# Altium project roach2_project rev2.PrjPCB (part 12 of 13)
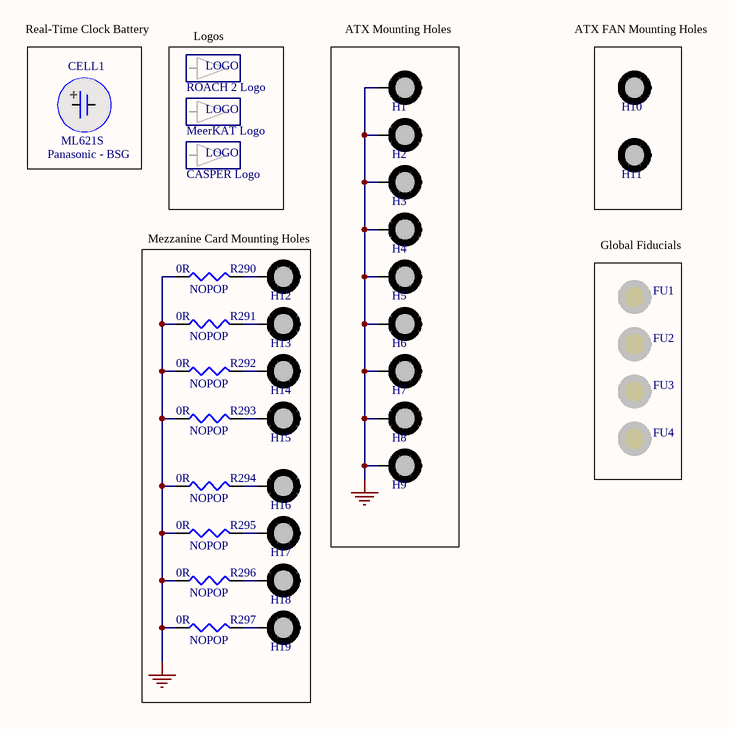
[diagram p25: misc.SchDoc]
## Nets that join several sheets
1V0: power_supply (R26.2 R27.2 U9.17), ppc_net (15 pins), ppc_sys (R37.2), v6_net (15 pins)
1V5: ddr3 (44 pins), gpio_led (F8.1 R430.2 R435.2 U68.1), jtag_levelxlate (R476.2 U75.1 U75.5), power_supply (18 pins), qdr0_1 (53 pins), qdr2_3 (61 pins), v6_config_io_16_17_21_22 (14 pins), v6_io_12_13_14_15 (31 pins), v6_io_23_24_25_26 (9 pins), v6_io_27_28_32_33 (31 pins), v6_io_34_35_36_37_38 (27 pins), ppc_power (5 pins), mgt_breakout (20 pins)
1V8: power_supply (R10.2 R11.2 U6.6 U8.14), ppc_cpld (5 pins), qdr0_1 (38 pins), qdr2_3 (38 pins), zdoks (10 pins), ppc_power (L9.1), ppc_ddr2_0 (29 pins), ppc_ddr2_1 (104 pins)
2V5: gpio_led (8 pins), jtag_levelxlate (20 pins), power_supply (R3.2 R4.2 U3.6 U6.10), ppc_net (33 pins), v6_config_io_16_17_21_22 (25 pins), v6_io_23_24_25_26 (23 pins), v6_io_34_35_36_37_38 (8 pins), zdoks (10 pins), ppc_power (L12.1), mgt_breakout (L25.2 L26.2 R493.1 R494.1), v6_net (32 pins)
3V3: ddr3 (J6.236 R376.2 R377.2), gpio_led (6 pins), jtag_levelxlate (37 pins), power_supply (8 pins), ppc_cpld (28 pins), ppc_extbus (25 pins), ppc_serial (29 pins), ppc_sys (15 pins), zdoks (10 pins), ppc_power (L10.1 L15.1 L16.2), mgt_breakout (36 pins)
3V3AUX: hwmon_2 (5 pins), gpio_led (8 pins), jtag_levelxlate (R49.2 R50.2), power_supply (8 pins), ppc_serial (18 pins), ppc_sys (R257.1)
5V: ddr3 (C661.2 R380.1 R382.1 U63.10), gpio_led (12 pins), power_supply (8 pins), ppc_serial (F6.2), qdr0_1 (C566.2 R323.1 R324.1 U59.10), qdr2_3 (C626.2 R374.1 R375.1 U62.10), zdoks (10 pins), ppc_ddr2_0 (C216.2 R189.2 R191.2 U41.10)
5VAUX: hwmon_2 (7 pins), gpio_led (F5.1 R449.1 R451.2), power_supply (15 pins)
12V: gpio_led (C728.2 U70.7), power_supply (6 pins)
DDR2_VREF: ppc_ddr2_0 (11 pins), ppc_ddr2_1 (12 pins)
GND: hwmon_2 (12 pins), ddr3 (99 pins), gpio_led (118 pins), jtag_levelxlate (90 pins), power_supply (94 pins), ppc_cpld (41 pins), ppc_extbus (10 pins), ppc_net (75 pins), ppc_serial (91 pins), ppc_sys (34 pins), qdr0_1 (119 pins), qdr2_3 (121 pins), v6_config_io_16_17_21_22 (21 pins), v6_io_12_13_14_15 (16 pins), v6_io_23_24_25_26 (12 pins), v6_io_27_28_32_33 (14 pins), v6_io_34_35_36_37_38 (13 pins), zdoks (104 pins), ppc_power (303 pins), mgt_breakout (238 pins), v6_net (73 pins), ppc_ddr2_0 (28 pins), ppc_ddr2_1 (104 pins), misc (17 pins)
N12V: gpio_led (C485.2 U70.4), power_supply (J1.14 P1.10)
QDR01_VREF: qdr0_1 (6 pins), v6_io_27_28_32_33 (6 pins), v6_io_34_35_36_37_38 (12 pins)
QDR23_VREF: qdr2_3 (6 pins), v6_config_io_16_17_21_22 (C368.2 U1.AY25 U1.BA27), v6_io_12_13_14_15 (6 pins), v6_io_27_28_32_33 (6 pins)
VCC_JTAG: jtag_levelxlate (C730.2 C731.2 P17.6 R468.1), ppc_sys (P2.12)
AUX_CLK_N: gpio_led (U67.10), v6_io_34_35_36_37_38 (U1.AW16)
AUX_CLK_P: gpio_led (U67.12), v6_io_34_35_36_37_38 (U1.AV16)
AUX_SYNCI_N: gpio_led (U69.10), v6_io_34_35_36_37_38 (U1.BB17)
AUX_SYNCI_P: gpio_led (U69.12), v6_io_34_35_36_37_38 (U1.BB16)
AUX_SYNCO_N: gpio_led (U71.4), v6_io_34_35_36_37_38 (U1.BA17)
AUX_SYNCO_P: gpio_led (U71.3), v6_io_34_35_36_37_38 (U1.BA16)
BOOT_CFG0: ppc_cpld (R342.1 U46.74), ppc_serial (U35.1)
BOOT_CFG1: ppc_cpld (R345.2 U46.73), ppc_serial (U37.1)
BOOT_CFG2: ppc_cpld (R344.2 U46.72), ppc_serial (U39.1)
BOOT_CFG_DISn: ppc_cpld (U46.71), ppc_serial (R150.1 U35.6 U37.6 U39.6)
CPLD_IRQn: ppc_cpld (U46.90), ppc_sys (R88.1 U2.V32)
CPLD_PRDY: jtag_levelxlate (R269.1 U86.2), ppc_cpld (U46.95)
CPLD_TCK: jtag_levelxlate (U77.16), ppc_cpld (U46.48)
CPLD_TDI: jtag_levelxlate (R479.2), ppc_cpld (U46.45)
CPLD_TDO: jtag_levelxlate (R480.1 U52.4), ppc_cpld (U46.83)
CPLD_TMS: jtag_levelxlate (U79.9), ppc_cpld (U46.47)
DDR2.A0: ppc_ddr2_0 (R151.2 RP6.1), ppc_ddr2_1 (U42.M8 U43.M8 U44.M8 U45.M8)
DDR2.A1: ppc_ddr2_0 (R152.2 RP4.1), ppc_ddr2_1 (U42.M3 U43.M3 U44.M3 U45.M3)
DDR2.A2: ppc_ddr2_0 (R153.2 RP3.3), ppc_ddr2_1 (U42.M7 U43.M7 U44.M7 U45.M7)
DDR2.A3: ppc_ddr2_0 (R154.2 RP4.2), ppc_ddr2_1 (U42.N2 U43.N2 U44.N2 U45.N2)
DDR2.A4: ppc_ddr2_0 (R155.2 RP3.1), ppc_ddr2_1 (U42.N8 U43.N8 U44.N8 U45.N8)
DDR2.A5: ppc_ddr2_0 (R156.2 RP3.2), ppc_ddr2_1 (U42.N3 U43.N3 U44.N3 U45.N3)
DDR2.A6: ppc_ddr2_0 (R157.2 RP3.4), ppc_ddr2_1 (U42.N7 U43.N7 U44.N7 U45.N7)
DDR2.A7: ppc_ddr2_0 (R158.2 RP2.1), ppc_ddr2_1 (U42.P2 U43.P2 U44.P2 U45.P2)
DDR2.A8: ppc_ddr2_0 (R159.2 RP2.4), ppc_ddr2_1 (U42.P8 U43.P8 U44.P8 U45.P8)
DDR2.A9: ppc_ddr2_0 (R160.2 RP2.2), ppc_ddr2_1 (U42.P3 U43.P3 U44.P3 U45.P3)
DDR2.A10: ppc_ddr2_0 (R161.2 RP5.3), ppc_ddr2_1 (U42.M2 U43.M2 U44.M2 U45.M2)
DDR2.A11: ppc_ddr2_0 (R162.2 RP1.2), ppc_ddr2_1 (U42.P7 U43.P7 U44.P7 U45.P7)
DDR2.A12: ppc_ddr2_0 (R163.2 RP1.3), ppc_ddr2_1 (U42.R2 U43.R2 U44.R2 U45.R2)
DDR2.A13: ppc_ddr2_0 (R164.2 RP4.3), ppc_ddr2_1 (U42.R8 U43.R8 U44.R8 U45.R8)
DDR2.BA0: ppc_ddr2_0 (R165.2 RP5.2), ppc_ddr2_1 (U42.L2 U43.L2 U44.L2 U45.L2)
DDR2.BA1: ppc_ddr2_0 (R166.2 RP5.1), ppc_ddr2_1 (U42.L3 U43.L3 U44.L3 U45.L3)
DDR2.BA2: ppc_ddr2_0 (R167.2 RP1.4), ppc_ddr2_1 (U42.L1 U43.L1 U44.L1 U45.L1)
DDR2.CASn: ppc_ddr2_0 (R169.2 RP4.4), ppc_ddr2_1 (U42.L7 U43.L7 U44.L7 U45.L7)
DDR2.CKE: ppc_ddr2_0 (R287.2 RP2.3), ppc_ddr2_1 (U42.K2 U43.K2 U44.K2 U45.K2)
DDR2.CLK_N0: ppc_ddr2_0 (R177.2 U40.40), ppc_ddr2_1 (U42.K8)
DDR2.CLK_N1: ppc_ddr2_0 (R178.2 U40.30), ppc_ddr2_1 (U43.K8)
DDR2.CLK_N2: ppc_ddr2_0 (R179.2 U40.18), ppc_ddr2_1 (U44.K8)
DDR2.CLK_N3: ppc_ddr2_0 (R180.2 U40.17), ppc_ddr2_1 (U45.K8)
DDR2.CLK_P0: ppc_ddr2_0 (R177.1 U40.39), ppc_ddr2_1 (U42.J8)
DDR2.CLK_P1: ppc_ddr2_0 (R178.1 U40.29), ppc_ddr2_1 (U43.J8)
DDR2.CLK_P2: ppc_ddr2_0 (R179.1 U40.19), ppc_ddr2_1 (U44.J8)
DDR2.CLK_P3: ppc_ddr2_0 (R180.1 U40.16), ppc_ddr2_1 (U45.J8)
DDR2.DM0: ppc_ddr2_0 (U2.AL21), ppc_ddr2_1 (U42.F3)
DDR2.DM1: ppc_ddr2_0 (U2.AM18), ppc_ddr2_1 (U42.B3)
DDR2.DM2: ppc_ddr2_0 (U2.AP15), ppc_ddr2_1 (U43.F3)
DDR2.DM3: ppc_ddr2_0 (U2.AL14), ppc_ddr2_1 (U43.B3)
DDR2.DM4: ppc_ddr2_0 (U2.AE4), ppc_ddr2_1 (U44.F3)
DDR2.DM5: ppc_ddr2_0 (U2.AB3), ppc_ddr2_1 (U44.B3)
DDR2.DM6: ppc_ddr2_0 (U2.Y1), ppc_ddr2_1 (U45.F3)
DDR2.DM7: ppc_ddr2_0 (U2.U3), ppc_ddr2_1 (U45.B3)
DDR2.DQ0: ppc_ddr2_0 (U2.AN22), ppc_ddr2_1 (U42.G8)
DDR2.DQ1: ppc_ddr2_0 (U2.AP22), ppc_ddr2_1 (U42.G2)
DDR2.DQ2: ppc_ddr2_0 (U2.AM20), ppc_ddr2_1 (U42.H7)
DDR2.DQ3: ppc_ddr2_0 (U2.AL20), ppc_ddr2_1 (U42.H3)
DDR2.DQ4: ppc_ddr2_0 (U2.AL22), ppc_ddr2_1 (U42.H1)
DDR2.DQ5: ppc_ddr2_0 (U2.AM22), ppc_ddr2_1 (U42.H9)
DDR2.DQ6: ppc_ddr2_0 (U2.AN21), ppc_ddr2_1 (U42.F1)
DDR2.DQ7: ppc_ddr2_0 (U2.AP21), ppc_ddr2_1 (U42.F9)
DDR2.DQ8: ppc_ddr2_0 (U2.AP20), ppc_ddr2_1 (U42.C8)
DDR2.DQ9: ppc_ddr2_0 (U2.AL18), ppc_ddr2_1 (U42.C2)
DDR2.DQ10: ppc_ddr2_0 (U2.AN17), ppc_ddr2_1 (U42.D7)
DDR2.DQ11: ppc_ddr2_0 (U2.AP17), ppc_ddr2_1 (U42.D3)
DDR2.DQ12: ppc_ddr2_0 (U2.AN20), ppc_ddr2_1 (U42.D1)
DDR2.DQ13: ppc_ddr2_0 (U2.AP19), ppc_ddr2_1 (U42.D9)
DDR2.DQ14: ppc_ddr2_0 (U2.AN18), ppc_ddr2_1 (U42.B1)
DDR2.DQ15: ppc_ddr2_0 (U2.AP18), ppc_ddr2_1 (U42.B9)
DDR2.DQ16: ppc_ddr2_0 (U2.AM16), ppc_ddr2_1 (U43.G8)
DDR2.DQ17: ppc_ddr2_0 (U2.AP16), ppc_ddr2_1 (U43.G2)
DDR2.DQ18: ppc_ddr2_0 (U2.AL15), ppc_ddr2_1 (U43.H7)
DDR2.DQ19: ppc_ddr2_0 (U2.AP14), ppc_ddr2_1 (U43.H3)
DDR2.DQ20: ppc_ddr2_0 (U2.AL17), ppc_ddr2_1 (U43.H1)
DDR2.DQ21: ppc_ddr2_0 (U2.AM17), ppc_ddr2_1 (U43.H9)
DDR2.DQ22: ppc_ddr2_0 (U2.AN15), ppc_ddr2_1 (U43.F1)
DDR2.DQ23: ppc_ddr2_0 (U2.AM15), ppc_ddr2_1 (U43.F9)
DDR2.DQ24: ppc_ddr2_0 (U2.AP13), ppc_ddr2_1 (U43.C8)
DDR2.DQ25: ppc_ddr2_0 (U2.AN13), ppc_ddr2_1 (U43.C2)
DDR2.DQ26: ppc_ddr2_0 (U2.AP12), ppc_ddr2_1 (U43.D7)
DDR2.DQ27: ppc_ddr2_0 (U2.AL12), ppc_ddr2_1 (U43.D3)
DDR2.DQ28: ppc_ddr2_0 (U2.AM14), ppc_ddr2_1 (U43.D1)
DDR2.DQ29: ppc_ddr2_0 (U2.AN14), ppc_ddr2_1 (U43.D9)
DDR2.DQ30: ppc_ddr2_0 (U2.AL13), ppc_ddr2_1 (U43.B1)
DDR2.DQ31: ppc_ddr2_0 (U2.AM12), ppc_ddr2_1 (U43.B9)
DDR2.DQ32: ppc_ddr2_0 (U2.AF3), ppc_ddr2_1 (U44.G8)
DDR2.DQ33: ppc_ddr2_0 (U2.AF1), ppc_ddr2_1 (U44.G2)
DDR2.DQ34: ppc_ddr2_0 (U2.AD4), ppc_ddr2_1 (U44.H7)
DDR2.DQ35: ppc_ddr2_0 (U2.AD3), ppc_ddr2_1 (U44.H3)
DDR2.DQ36: ppc_ddr2_0 (U2.AG3), ppc_ddr2_1 (U44.H1)
DDR2.DQ37: ppc_ddr2_0 (U2.AF2), ppc_ddr2_1 (U44.H9)
DDR2.DQ38: ppc_ddr2_0 (U2.AE2), ppc_ddr2_1 (U44.F1)
DDR2.DQ39: ppc_ddr2_0 (U2.AE1), ppc_ddr2_1 (U44.F9)
DDR2.DQ40: ppc_ddr2_0 (U2.AC3), ppc_ddr2_1 (U44.C8)
DDR2.DQ41: ppc_ddr2_0 (U2.AC1), ppc_ddr2_1 (U44.C2)
DDR2.DQ42: ppc_ddr2_0 (U2.AA4), ppc_ddr2_1 (U44.D7)
DDR2.DQ43: ppc_ddr2_0 (U2.AA3), ppc_ddr2_1 (U44.D3)
DDR2.DQ44: ppc_ddr2_0 (U2.AD2), ppc_ddr2_1 (U44.D1)
DDR2.DQ45: ppc_ddr2_0 (U2.AC4), ppc_ddr2_1 (U44.D9)
DDR2.DQ46: ppc_ddr2_0 (U2.AB1), ppc_ddr2_1 (U44.B1)
DDR2.DQ47: ppc_ddr2_0 (U2.AB2), ppc_ddr2_1 (U44.B9)
DDR2.DQ48: ppc_ddr2_0 (U2.Y3), ppc_ddr2_1 (U45.G8)
DDR2.DQ49: ppc_ddr2_0 (U2.Y2), ppc_ddr2_1 (U45.G2)
DDR2.DQ50: ppc_ddr2_0 (U2.V4), ppc_ddr2_1 (U45.H7)
DDR2.DQ51: ppc_ddr2_0 (U2.V3), ppc_ddr2_1 (U45.H3)
DDR2.DQ52: ppc_ddr2_0 (U2.AA2), ppc_ddr2_1 (U45.H1)
DDR2.DQ53: ppc_ddr2_0 (U2.AA1), ppc_ddr2_1 (U45.H9)
DDR2.DQ54: ppc_ddr2_0 (U2.W3), ppc_ddr2_1 (U45.F1)
DDR2.DQ55: ppc_ddr2_0 (U2.W1), ppc_ddr2_1 (U45.F9)
DDR2.DQ56: ppc_ddr2_0 (U2.U1), ppc_ddr2_1 (U45.C8)
DDR2.DQ57: ppc_ddr2_0 (U2.U2), ppc_ddr2_1 (U45.C2)
DDR2.DQ58: ppc_ddr2_0 (U2.T4), ppc_ddr2_1 (U45.D7)
DDR2.DQ59: ppc_ddr2_0 (U2.R1), ppc_ddr2_1 (U45.D3)
DDR2.DQ60: ppc_ddr2_0 (U2.V2), ppc_ddr2_1 (U45.D1)
DDR2.DQ61: ppc_ddr2_0 (U2.V1), ppc_ddr2_1 (U45.D9)
DDR2.DQ62: ppc_ddr2_0 (U2.T1), ppc_ddr2_1 (U45.B1)
DDR2.DQ63: ppc_ddr2_0 (U2.T3), ppc_ddr2_1 (U45.B9)
DDR2.DQS0: ppc_ddr2_0 (U2.AM21), ppc_ddr2_1 (U42.F7)
DDR2.DQS1: ppc_ddr2_0 (U2.AM19), ppc_ddr2_1 (U42.B7)
DDR2.DQS2: ppc_ddr2_0 (U2.AL16), ppc_ddr2_1 (U43.F7)
DDR2.DQS3: ppc_ddr2_0 (U2.AM13), ppc_ddr2_1 (U43.B7)
DDR2.DQS4: ppc_ddr2_0 (U2.AE3), ppc_ddr2_1 (U44.F7)
DDR2.DQS5: ppc_ddr2_0 (U2.AB4), ppc_ddr2_1 (U44.B7)
DDR2.DQS6: ppc_ddr2_0 (U2.W4), ppc_ddr2_1 (U45.F7)
DDR2.DQS7: ppc_ddr2_0 (U2.U4), ppc_ddr2_1 (U45.B7)
DDR2.ODT: ppc_ddr2_0 (R285.2 RP6.2), ppc_ddr2_1 (U42.K9 U43.K9 U44.K9 U45.K9)
DDR2.RASn: ppc_ddr2_0 (R168.2 RP5.4), ppc_ddr2_1 (U42.K7 U43.K7 U44.K7 U45.K7)
DDR2.Sn: ppc_ddr2_0 (R286.2 RP6.3), ppc_ddr2_1 (U42.L8 U43.L8 U44.L8 U45.L8)
DDR2.WEn: ppc_ddr2_0 (R170.2 RP6.4), ppc_ddr2_1 (U42.K3 U43.K3 U44.K3 U45.K3)
DDR3.A0: ddr3 (J6.188), v6_io_12_13_14_15 (U1.BB38)
DDR3.A1: ddr3 (J6.181), v6_io_12_13_14_15 (U1.BB37)
DDR3.A2: ddr3 (J6.61), v6_io_12_13_14_15 (U1.BA37)
DDR3.A3: ddr3 (J6.180), v6_io_12_13_14_15 (U1.BA36)
DDR3.A4: ddr3 (J6.59), v6_io_12_13_14_15 (U1.BB36)
DDR3.A5: ddr3 (J6.58), v6_io_12_13_14_15 (U1.BA35)
DDR3.A6: ddr3 (J6.178), v6_io_12_13_14_15 (U1.AW36)
DDR3.A7: ddr3 (J6.56), v6_io_12_13_14_15 (U1.AY35)
DDR3.A8: ddr3 (J6.177), v6_io_12_13_14_15 (U1.BA34)
DDR3.A9: ddr3 (J6.175), v6_io_12_13_14_15 (U1.AW35)
DDR3.A10: ddr3 (J6.70), v6_io_12_13_14_15 (U1.BB39)
DDR3.A11: ddr3 (J6.55), v6_io_12_13_14_15 (U1.BB34)
DDR3.A12: ddr3 (J6.174), v6_io_12_13_14_15 (U1.AY34)
DDR3.A13: ddr3 (J6.196), v6_io_12_13_14_15 (U1.AT34)
DDR3.A14: ddr3 (J6.172), v6_config_io_16_17_21_22 (U1.BB33)
DDR3.A15: ddr3 (J6.171), v6_config_io_16_17_21_22 (U1.BB31)
DDR3.BA0: ddr3 (J6.71), v6_io_12_13_14_15 (U1.AW37)
DDR3.BA1: ddr3 (J6.190), v6_io_12_13_14_15 (U1.AY37)
DDR3.BA2: ddr3 (J6.52), v6_config_io_16_17_21_22 (U1.AY32)
DDR3.CASn: ddr3 (J6.74), v6_io_12_13_14_15 (U1.AU34)
DDR3.CK_N: ddr3 (J6.185), v6_config_io_16_17_21_22 (U1.AY33)
DDR3.CK_P: ddr3 (J6.184), v6_config_io_16_17_21_22 (U1.BA32)
DDR3.CKE0: ddr3 (J6.50), v6_io_12_13_14_15 (U1.AV34)
DDR3.CKE1: ddr3 (J6.169), v6_io_12_13_14_15 (U1.AV35)
DDR3.DM0: ddr3 (J6.125), v6_io_23_24_25_26 (R340.1)
DDR3.DM1: ddr3 (J6.134), v6_config_io_16_17_21_22 (R300.1)
DDR3.DM2: ddr3 (J6.143), v6_config_io_16_17_21_22 (R334.1)
DDR3.DM3: ddr3 (J6.152), v6_config_io_16_17_21_22 (R335.1)
DDR3.DM4: ddr3 (J6.203), v6_io_23_24_25_26 (R339.1)
DDR3.DM5: ddr3 (J6.212), v6_io_12_13_14_15 (R336.1)
DDR3.DM6: ddr3 (J6.221), v6_io_12_13_14_15 (R337.1)
DDR3.DM7: ddr3 (J6.230), v6_io_12_13_14_15 (R338.1)
DDR3.DM8: ddr3 (J6.161), v6_io_23_24_25_26 (R341.1)
DDR3.DQ0: ddr3 (J6.3), v6_io_23_24_25_26 (U1.AH25)
DDR3.DQ1: ddr3 (J6.4), v6_io_23_24_25_26 (U1.AM29)
DDR3.DQ2: ddr3 (J6.9), v6_io_23_24_25_26 (U1.AM28)
DDR3.DQ3: ddr3 (J6.10), v6_io_23_24_25_26 (U1.AN29)
DDR3.DQ4: ddr3 (J6.122), v6_io_23_24_25_26 (U1.AG27)
DDR3.DQ5: ddr3 (J6.123), v6_io_23_24_25_26 (U1.AH26)
DDR3.DQ6: ddr3 (J6.128), v6_io_23_24_25_26 (U1.AL27)
DDR3.DQ7: ddr3 (J6.129), v6_io_23_24_25_26 (U1.AK25)
DDR3.DQ8: ddr3 (J6.12), v6_config_io_16_17_21_22 (U1.AP28)
DDR3.DQ9: ddr3 (J6.13), v6_config_io_16_17_21_22 (U1.AY30)
DDR3.DQ10: ddr3 (J6.18), v6_config_io_16_17_21_22 (U1.AR29)
DDR3.DQ11: ddr3 (J6.19), v6_config_io_16_17_21_22 (U1.AR30)
DDR3.DQ12: ddr3 (J6.131), v6_config_io_16_17_21_22 (U1.AM27)
DDR3.DQ13: ddr3 (J6.132), v6_config_io_16_17_21_22 (U1.AN26)
DDR3.DQ14: ddr3 (J6.137), v6_config_io_16_17_21_22 (U1.AW28)
DDR3.DQ15: ddr3 (J6.138), v6_config_io_16_17_21_22 (U1.AV29)
DDR3.DQ16: ddr3 (J6.21), v6_config_io_16_17_21_22 (U1.AY28)
DDR3.DQ17: ddr3 (J6.22), v6_config_io_16_17_21_22 (U1.AU29)
DDR3.DQ18: ddr3 (J6.27), v6_config_io_16_17_21_22 (U1.AW31)
DDR3.DQ19: ddr3 (J6.28), v6_config_io_16_17_21_22 (U1.AU31)
DDR3.DQ20: ddr3 (J6.140), v6_config_io_16_17_21_22 (U1.AL26)
DDR3.DQ21: ddr3 (J6.141), v6_config_io_16_17_21_22 (U1.BB28)
DDR3.DQ22: ddr3 (J6.146), v6_config_io_16_17_21_22 (U1.AV30)
DDR3.DQ23: ddr3 (J6.147), v6_config_io_16_17_21_22 (U1.AT30)
DDR3.DQ24: ddr3 (J6.30), v6_config_io_16_17_21_22 (U1.AT29)
DDR3.DQ25: ddr3 (J6.31), v6_config_io_16_17_21_22 (U1.AW30)
DDR3.DQ26: ddr3 (J6.36), v6_config_io_16_17_21_22 (U1.BA31)
DDR3.DQ27: ddr3 (J6.37), v6_config_io_16_17_21_22 (U1.AV31)
DDR3.DQ28: ddr3 (J6.149), v6_config_io_16_17_21_22 (U1.AP27)
DDR3.DQ29: ddr3 (J6.150), v6_config_io_16_17_21_22 (U1.AR28)
DDR3.DQ30: ddr3 (J6.155), v6_config_io_16_17_21_22 (U1.BB29)
DDR3.DQ31: ddr3 (J6.156), v6_config_io_16_17_21_22 (U1.AT31)
DDR3.DQ32: ddr3 (J6.81), v6_io_23_24_25_26 (U1.AU33)
DDR3.DQ33: ddr3 (J6.82), v6_io_23_24_25_26 (U1.AV33)
DDR3.DQ34: ddr3 (J6.87), v6_io_23_24_25_26 (U1.AP33)
DDR3.DQ35: ddr3 (J6.88), v6_io_23_24_25_26 (U1.AM32)
DDR3.DQ36: ddr3 (J6.200), v6_io_23_24_25_26 (U1.AT32)
DDR3.DQ37: ddr3 (J6.201), v6_io_23_24_25_26 (U1.AW33)
DDR3.DQ38: ddr3 (J6.206), v6_io_23_24_25_26 (U1.AR33)
DDR3.DQ39: ddr3 (J6.207), v6_io_23_24_25_26 (U1.AP32)
DDR3.DQ40: ddr3 (J6.90), v6_io_12_13_14_15 (U1.BA40)
DDR3.DQ41: ddr3 (J6.91), v6_io_12_13_14_15 (U1.BA41)
DDR3.DQ42: ddr3 (J6.96), v6_io_12_13_14_15 (U1.AK34)
DDR3.DQ43: ddr3 (J6.97), v6_io_12_13_14_15 (U1.AP38)
DDR3.DQ44: ddr3 (J6.209), v6_io_12_13_14_15 (U1.AM34)
DDR3.DQ45: ddr3 (J6.210), v6_io_12_13_14_15 (U1.AL35)
DDR3.DQ46: ddr3 (J6.215), v6_io_12_13_14_15 (U1.AM36)
DDR3.DQ47: ddr3 (J6.216), v6_io_12_13_14_15 (U1.AY40)
DDR3.DQ48: ddr3 (J6.99), v6_io_12_13_14_15 (U1.BA42)
DDR3.DQ49: ddr3 (J6.100), v6_io_12_13_14_15 (U1.AW41)
DDR3.DQ50: ddr3 (J6.105), v6_io_12_13_14_15 (U1.AU39)
DDR3.DQ51: ddr3 (J6.106), v6_io_12_13_14_15 (U1.AL37)
DDR3.DQ52: ddr3 (J6.218), v6_io_12_13_14_15 (U1.AW40)
DDR3.DQ53: ddr3 (J6.219), v6_io_12_13_14_15 (U1.AV40)
DDR3.DQ54: ddr3 (J6.224), v6_io_12_13_14_15 (U1.BB41)
DDR3.DQ55: ddr3 (J6.225), v6_io_12_13_14_15 (U1.AN38)
DDR3.DQ56: ddr3 (J6.108), v6_io_12_13_14_15 (U1.AY42)
DDR3.DQ57: ddr3 (J6.109), v6_io_12_13_14_15 (U1.AP40)
DDR3.DQ58: ddr3 (J6.114), v6_io_12_13_14_15 (U1.AR42)
DDR3.DQ59: ddr3 (J6.115), v6_io_12_13_14_15 (U1.AN41)
DDR3.DQ60: ddr3 (J6.227), v6_io_12_13_14_15 (U1.AN40)
DDR3.DQ61: ddr3 (J6.228), v6_io_12_13_14_15 (U1.AN39)
DDR3.DQ62: ddr3 (J6.233), v6_io_12_13_14_15 (U1.AT41)
DDR3.DQ63: ddr3 (J6.234), v6_io_12_13_14_15 (U1.AT42)
DDR3.DQ64: ddr3 (J6.39), v6_io_23_24_25_26 (U1.AL29)
DDR3.DQ65: ddr3 (J6.40), v6_io_23_24_25_26 (U1.AN30)
DDR3.DQ66: ddr3 (J6.45), v6_io_23_24_25_26 (U1.AL31)
DDR3.DQ67: ddr3 (J6.46), v6_io_23_24_25_26 (U1.AG28)
DDR3.DQ68: ddr3 (J6.158), v6_io_23_24_25_26 (U1.AJ26)
DDR3.DQ69: ddr3 (J6.159), v6_io_23_24_25_26 (U1.AK29)
DDR3.DQ70: ddr3 (J6.164), v6_io_23_24_25_26 (U1.AL30)
DDR3.DQ71: ddr3 (J6.165), v6_io_23_24_25_26 (U1.AP30)
DDR3.DQS_N0: ddr3 (J6.6), v6_io_23_24_25_26 (U1.AJ27)
DDR3.DQS_N1: ddr3 (J6.15), v6_config_io_16_17_21_22 (U1.AV28)
DDR3.DQS_N2: ddr3 (J6.24), v6_config_io_16_17_21_22 (U1.AT27)
DDR3.DQS_N3: ddr3 (J6.33), v6_config_io_16_17_21_22 (U1.BA29)
DDR3.DQS_N4: ddr3 (J6.84), v6_io_23_24_25_26 (U1.AN34)
DDR3.DQS_N5: ddr3 (J6.93), v6_io_12_13_14_15 (U1.AL36)
DDR3.DQS_N6: ddr3 (J6.102), v6_io_12_13_14_15 (U1.AT39)
DDR3.DQS_N7: ddr3 (J6.111), v6_io_12_13_14_15 (U1.AU41)
DDR3.DQS_N8: ddr3 (J6.42), v6_io_23_24_25_26 (U1.AN31)
DDR3.DQS_P0: ddr3 (J6.7), v6_io_23_24_25_26 (U1.AK27)
DDR3.DQS_P1: ddr3 (J6.16), v6_config_io_16_17_21_22 (U1.AU28)
DDR3.DQS_P2: ddr3 (J6.25), v6_config_io_16_17_21_22 (U1.AR27)
DDR3.DQS_P3: ddr3 (J6.34), v6_config_io_16_17_21_22 (U1.AY29)
DDR3.DQS_P4: ddr3 (J6.85), v6_io_23_24_25_26 (U1.AN33)
DDR3.DQS_P5: ddr3 (J6.94), v6_io_12_13_14_15 (U1.AK35)
DDR3.DQS_P6: ddr3 (J6.103), v6_io_12_13_14_15 (U1.AR39)
DDR3.DQS_P7: ddr3 (J6.112), v6_io_12_13_14_15 (U1.AV41)
DDR3.DQS_P8: ddr3 (J6.43), v6_io_23_24_25_26 (U1.AP31)
DDR3.ODT0: ddr3 (J6.195), v6_io_12_13_14_15 (U1.AU36)
DDR3.ODT1: ddr3 (J6.77), v6_io_12_13_14_15 (U1.AV36)
DDR3.RASn: ddr3 (J6.192), v6_io_12_13_14_15 (U1.AY38)
DDR3.RESETn: ddr3 (J6.168), v6_io_34_35_36_37_38 (U1.N13)
DDR3.Sn0: ddr3 (J6.193), v6_io_12_13_14_15 (U1.AW38)
DDR3.Sn1: ddr3 (J6.76), v6_io_12_13_14_15 (U1.AR37)
DDR3.Sn2: ddr3 (J6.79), v6_io_12_13_14_15 (U1.AP36)
DDR3.Sn3: ddr3 (J6.198), v6_io_12_13_14_15 (U1.AH34)
DDR3.WEn: ddr3 (J6.73), v6_io_12_13_14_15 (U1.AV38)
EPB.PADDR5: jtag_levelxlate (U76.55), ppc_extbus (R352.2 U2.D25 U30.G8)
EPB.PADDR6: jtag_levelxlate (U76.54), ppc_extbus (R351.2 U2.C25 U30.F8)
EPB.PADDR7: jtag_levelxlate (U76.52), ppc_extbus (R350.2 U2.B25 U30.C8)
EPB.PADDR8: jtag_levelxlate (U76.51), ppc_extbus (U2.A25 U30.B8)
EPB.PADDR9: jtag_levelxlate (U76.49), ppc_extbus (U2.C24 U30.C5)
EPB.PADDR10: jtag_levelxlate (U76.48), ppc_extbus (U2.D24 U30.D4)
EPB.PADDR11: jtag_levelxlate (U76.47), ppc_extbus (U2.B24 U30.D5)
EPB.PADDR12: jtag_levelxlate (U76.45), ppc_extbus (U2.D23 U30.C4)
EPB.PADDR13: jtag_levelxlate (U76.44), ppc_extbus (U2.A24 U30.B3)
EPB.PADDR14: jtag_levelxlate (U76.43), ppc_extbus (U2.C23 U30.E7)
EPB.PADDR15: jtag_levelxlate (U76.42), ppc_extbus (U2.A23 U30.D7)
EPB.PADDR16: jtag_levelxlate (U76.41), ppc_extbus (U2.D22 U30.C7)
EPB.PADDR17: jtag_levelxlate (U76.40), ppc_extbus (U2.C22 U30.A7)
EPB.PADDR18: jtag_levelxlate (U76.38), ppc_extbus (U2.A22 U30.B7)
EPB.PADDR19: jtag_levelxlate (U76.37), ppc_extbus (U2.D21 U30.D6)
EPB.PADDR20: jtag_levelxlate (U76.36), ppc_extbus (U2.C21 U30.C6)
EPB.PADDR21: jtag_levelxlate (U76.34), ppc_extbus (U2.B21 U30.A6)
EPB.PADDR22: jtag_levelxlate (U76.33), ppc_extbus (U2.A21 U30.B6)
EPB.PADDR23: jtag_levelxlate (U80.55), ppc_extbus (U2.D20 U30.A3)
EPB.PADDR24: jtag_levelxlate (U76.31), ppc_extbus (U2.C20 U30.C3)
EPB.PADDR25: jtag_levelxlate (U76.30), ppc_extbus (U2.B20 U30.D3)
EPB.PADDR26: jtag_levelxlate (U80.54), ppc_cpld (U46.8), ppc_extbus (U2.D19 U30.B2)
EPB.PADDR27: jtag_levelxlate (U80.52), ppc_cpld (U46.7), ppc_extbus (U2.C19 U30.A2)
EPB.PADDR28: jtag_levelxlate (U80.51), ppc_cpld (U46.6), ppc_extbus (U2.A19 U30.C2)
EPB.PADDR29: jtag_levelxlate (U80.49), ppc_cpld (U46.4), ppc_extbus (U2.D18 U30.D2)
EPB.PADDR30: ppc_cpld (U46.3), ppc_extbus (U2.C18 U30.E2)
EPB.PADDR31: ppc_cpld (U46.2), ppc_extbus (U2.B18)
EPB.PBEn0: jtag_levelxlate (U80.44), ppc_extbus (U2.A15)
EPB.PBEn1: jtag_levelxlate (U80.45), ppc_extbus (U2.B15)
EPB.PBEn2: jtag_levelxlate (U80.47), ppc_extbus (U2.C15)
EPB.PBEn3: jtag_levelxlate (U80.48), ppc_extbus (U2.D15)
EPB.PBLASTn: jtag_levelxlate (U80.41), ppc_extbus (U2.B7)
EPB.PCSn_CPLD: ppc_cpld (U46.97), ppc_extbus (R108.1 R118.2)
EPB.PCSn_FPGA0: jtag_levelxlate (U80.38), ppc_extbus (R107.1 R117.2)
EPB.PCSn_FPGA1: jtag_levelxlate (U80.40), ppc_extbus (R110.1 R121.2)
EPB.PCSn_SMAP: jtag_levelxlate (U80.37), ppc_extbus (R109.1 R120.2)
EPB.PDATA0: jtag_levelxlate (U81.47), ppc_cpld (U46.16), ppc_extbus (U2.C14 U30.G7)
EPB.PDATA1: jtag_levelxlate (U81.46), ppc_cpld (U46.15), ppc_extbus (U2.D14 U30.F6)
EPB.PDATA2: jtag_levelxlate (U81.44), ppc_cpld (U46.14), ppc_extbus (U2.A13 U30.G6)
EPB.PDATA3: jtag_levelxlate (U81.43), ppc_cpld (U46.13), ppc_extbus (U2.B13 U30.F5)
EPB.PDATA4: jtag_levelxlate (U81.41), ppc_cpld (U46.12), ppc_extbus (U2.C13 U30.G4)
EPB.PDATA5: jtag_levelxlate (U81.40), ppc_cpld (U46.11), ppc_extbus (U2.D13 U30.F4)
EPB.PDATA6: jtag_levelxlate (U81.38), ppc_cpld (U46.10), ppc_extbus (U2.A12 U30.G3)
EPB.PDATA7: jtag_levelxlate (U81.37), ppc_cpld (U46.9), ppc_extbus (U2.C12 U30.F3)
EPB.PDATA8: jtag_levelxlate (U81.36), ppc_extbus (U2.A11 U30.E6)
EPB.PDATA9: jtag_levelxlate (U81.35), ppc_extbus (U2.D12 U30.H6)
EPB.PDATA10: jtag_levelxlate (U81.33), ppc_extbus (U2.B11 U30.E5)
EPB.PDATA11: jtag_levelxlate (U81.32), ppc_extbus (U2.C11 U30.H5)
EPB.PDATA12: jtag_levelxlate (U81.30), ppc_extbus (U2.D11 U30.H4)
EPB.PDATA13: jtag_levelxlate (U81.29), ppc_extbus (U2.A10 U30.E4)
EPB.PDATA14: jtag_levelxlate (U81.27), ppc_extbus (U2.B10 U30.H3)
EPB.PDATA15: jtag_levelxlate (U81.26), ppc_extbus (U2.C10 U30.E3)
EPB.PDATA16: jtag_levelxlate (U78.47), ppc_extbus (U2.E3)
EPB.PDATA17: jtag_levelxlate (U78.46), ppc_extbus (U2.C1)
EPB.PDATA18: jtag_levelxlate (U78.44), ppc_extbus (U2.D2)
EPB.PDATA19: jtag_levelxlate (U78.43), ppc_extbus (U2.E4)
EPB.PDATA20: jtag_levelxlate (U78.41), ppc_extbus (U2.D1)
EPB.PDATA21: jtag_levelxlate (U78.40), ppc_extbus (U2.E1)
EPB.PDATA22: jtag_levelxlate (U78.38), ppc_extbus (U2.F4)
EPB.PDATA23: jtag_levelxlate (U78.37), ppc_extbus (U2.F3)
EPB.PDATA24: jtag_levelxlate (U78.36), ppc_extbus (U2.F2)
EPB.PDATA25: jtag_levelxlate (U78.35), ppc_extbus (U2.F1)
EPB.PDATA26: jtag_levelxlate (U78.33), ppc_extbus (U2.G3)
EPB.PDATA27: jtag_levelxlate (U78.32), ppc_extbus (U2.G4)
EPB.PDATA28: jtag_levelxlate (U78.30), ppc_extbus (U2.G2)
EPB.PDATA29: jtag_levelxlate (U78.29), ppc_extbus (U2.G1)
EPB.PDATA30: jtag_levelxlate (U78.27), ppc_extbus (U2.H4)
EPB.PDATA31: jtag_levelxlate (U78.26), ppc_extbus (TP29.1 U2.H3)
EPB.PERCLK: jtag_levelxlate (U73.3 U74.2), ppc_cpld (U46.22), ppc_extbus (R112.2 R122.2 R123.1 TP28.1)
EPB.POEn: jtag_levelxlate (U80.43), ppc_cpld (U46.1), ppc_extbus (U2.B14 U30.G2)
EPB.PRDY: jtag_levelxlate (U86.4), ppc_extbus (TP40.1 U2.C17)
EPB.PWRn: jtag_levelxlate (U80.42), ppc_cpld (U46.96), ppc_extbus (U2.A14 U30.A5)
FAULTn: gpio_led (Q17.1 R225.2), ppc_sys (R85.1 U2.AC31)
FLASH_BUSYn: ppc_cpld (U46.17), ppc_extbus (R106.1 U30.A4)
FTDI_CTRL0: ppc_cpld (U46.66), ppc_serial (U33.34)
FTDI_CTRL1: ppc_cpld (U46.67), ppc_serial (U33.33)
FTDI_CTRL2: ppc_cpld (U46.68), ppc_serial (U33.32)
FTDI_CTRL3: ppc_cpld (U46.70), ppc_serial (U33.30)
FTDI_TCK: jtag_levelxlate (R462.1), ppc_serial (U33.16)
FTDI_TDI: jtag_levelxlate (R464.1), ppc_serial (U33.17)
FTDI_TDO: jtag_levelxlate (R467.2), ppc_serial (U33.18)
FTDI_TMS: jtag_levelxlate (R465.1), ppc_serial (U33.19)
FTDI_TRSTn: jtag_levelxlate (R466.1), ppc_serial (U33.21)
GETH_IRQn: ppc_net (U50.L1), ppc_sys (R84.1 U2.AD33)
JTAG_GRAB: jtag_levelxlate (R252.2 U52.6 U53.6), ppc_serial (R243.2)
MGT_GPIO0: v6_io_34_35_36_37_38 (U1.J16), mgt_breakout (J7.C17)
MGT_GPIO1: v6_io_34_35_36_37_38 (U1.H20), mgt_breakout (J7.C18)
MGT_GPIO2: v6_io_34_35_36_37_38 (U1.N18), mgt_breakout (J7.C19)
MGT_GPIO3: v6_io_34_35_36_37_38 (U1.B16), mgt_breakout (J7.C20)
MGT_GPIO4: v6_io_27_28_32_33 (U1.L29), mgt_breakout (J7.C21)
MGT_GPIO5: v6_io_27_28_32_33 (U1.K29), mgt_breakout (J7.C22)
MGT_GPIO6: v6_io_34_35_36_37_38 (U1.N15), mgt_breakout (J8.C17)
MGT_GPIO7: v6_io_34_35_36_37_38 (U1.P16), mgt_breakout (J8.C18)
MGT_GPIO8: v6_io_34_35_36_37_38 (U1.N16), mgt_breakout (J8.C19)
MGT_GPIO9: v6_io_34_35_36_37_38 (U1.P17), mgt_breakout (J8.C20)
MGT_GPIO10: v6_io_34_35_36_37_38 (U1.L15), mgt_breakout (J8.C21)
MGT_GPIO11: v6_io_34_35_36_37_38 (U1.K19), mgt_breakout (J8.C22)
MMC_DMAACK: ppc_cpld (U46.93), ppc_sys (U2.T34)
MMC_DMAEOT: ppc_cpld (U46.92), ppc_sys (U2.T32)
MMC_DMAREQ: ppc_cpld (U46.91), ppc_sys (U2.U32)
PCTRL_EN: power_supply (Q19.1 R30.2), ppc_serial (R139.2)
PPC_GPIO0: gpio_led (P14.5 SP41.2), ppc_serial (U2.C6)
PPC_GPIO1: gpio_led (P14.4 SP40.2), ppc_serial (U2.A4)
PPC_GPIO2: gpio_led (P14.3 SP39.2), ppc_serial (U2.M3)
PPC_GPIO3: gpio_led (P14.2 SP38.2), ppc_serial (U2.P4)
PPC_GPIO4: gpio_led (Q12.1 R448.2 SP37.2), ppc_serial (U2.C5)
PPC_SCL: ddr3 (R378.2), ppc_serial (5 pins)
PPC_SDA: ddr3 (R379.2), ppc_serial (6 pins)
PPC_TCK: jtag_levelxlate (U77.14), ppc_sys (U2.P2)
PPC_TDI: jtag_levelxlate (R477.2), ppc_sys (U2.K3)
PPC_TDO: jtag_levelxlate (R478.1), ppc_sys (U2.B22)
PPC_TMS: jtag_levelxlate (U79.7), ppc_sys (U2.K2)
PPCNET_MDC: ppc_net (R235.2 U2.AL34 U50.L3), v6_net (U64.L3)
PPCNET_MDIO: ppc_net (R240.2 U2.AK34 U50.M1), v6_net (U64.M1)
PPCNET_TCK: jtag_levelxlate (U77.12), ppc_net (U50.L9)
PPCNET_TDI: jtag_levelxlate (R484.2), ppc_net (U50.L7)
PPCNET_TDO: jtag_levelxlate (R485.1), ppc_net (U50.K8)
PPCNET_TMS: jtag_levelxlate (U79.5), ppc_net (U50.L8)
QDR0.A0: qdr0_1 (RP9.1 U57.B4), v6_io_34_35_36_37_38 (U1.E19)
QDR0.A1: qdr0_1 (RP14.3 U57.B8), v6_io_34_35_36_37_38 (U1.J15)
QDR0.A2: qdr0_1 (R275.1 U57.C5), v6_io_34_35_36_37_38 (U1.J17)
QDR0.A3: qdr0_1 (R272.1 U57.C7), v6_io_34_35_36_37_38 (U1.G18)
QDR0.A4: qdr0_1 (RP13.2 U57.N5), v6_io_34_35_36_37_38 (U1.G19)
QDR0.A5: qdr0_1 (RP13.3 U57.N6), v6_io_34_35_36_37_38 (U1.G16)
QDR0.A6: qdr0_1 (RP13.4 U57.N7), v6_io_34_35_36_37_38 (U1.E18)
QDR0.A7: qdr0_1 (RP8.2 U57.P4), v6_io_34_35_36_37_38 (U1.F17)
QDR0.A8: qdr0_1 (RP8.4 U57.P5), v6_io_34_35_36_37_38 (U1.K18)
QDR0.A9: qdr0_1 (RP7.1 U57.P7), v6_io_34_35_36_37_38 (U1.C18)
QDR0.A10: qdr0_1 (RP7.3 U57.P8), v6_io_34_35_36_37_38 (U1.A17)
QDR0.A11: qdr0_1 (RP14.2 U57.A9), v6_io_34_35_36_37_38 (U1.G17)
QDR0.A12: qdr0_1 (RP8.1 U57.R3), v6_io_34_35_36_37_38 (U1.M18)
QDR0.A13: qdr0_1 (RP8.3 U57.R4), v6_io_34_35_36_37_38 (U1.B19)
QDR0.A14: qdr0_1 (RP13.1 U57.R5), v6_io_34_35_36_37_38 (U1.B17)
QDR0.A15: qdr0_1 (R114.1 U57.R7), v6_io_34_35_36_37_38 (U1.B18)
QDR0.A16: qdr0_1 (RP7.2 U57.R8), v6_io_34_35_36_37_38 (U1.D18)
QDR0.A17: qdr0_1 (RP7.4 U57.R9), v6_io_34_35_36_37_38 (U1.K17)
QDR0.A18: qdr0_1 (RP9.3 U57.A3), v6_io_34_35_36_37_38 (U1.C19)
QDR0.A19: qdr0_1 (RP14.1 U57.A10), v6_io_34_35_36_37_38 (U1.M16)
QDR0.A20: qdr0_1 (RP9.4 U57.A2), v6_io_34_35_36_37_38 (U1.F19)
QDR0.D0: qdr0_1 (U57.P10), v6_io_34_35_36_37_38 (U1.C16)
QDR0.D1: qdr0_1 (U57.N11), v6_io_34_35_36_37_38 (U1.N14)
QDR0.D2: qdr0_1 (U57.M11), v6_io_34_35_36_37_38 (U1.H13)
QDR0.D3: qdr0_1 (U57.K10), v6_io_34_35_36_37_38 (U1.K12)
QDR0.D4: qdr0_1 (U57.J11), v6_io_34_35_36_37_38 (U1.K13)
QDR0.D5: qdr0_1 (U57.G11), v6_io_34_35_36_37_38 (U1.J12)
QDR0.D6: qdr0_1 (U57.E10), v6_io_34_35_36_37_38 (U1.E14)
QDR0.D7: qdr0_1 (U57.D11), v6_io_34_35_36_37_38 (U1.D12)
QDR0.D8: qdr0_1 (U57.C11), v6_io_34_35_36_37_38 (U1.F12)
QDR0.D9: qdr0_1 (U57.N10), v6_io_34_35_36_37_38 (U1.H15)
QDR0.D10: qdr0_1 (U57.M9), v6_io_34_35_36_37_38 (U1.A15)
QDR0.D11: qdr0_1 (U57.L9), v6_io_34_35_36_37_38 (U1.E15)
QDR0.D12: qdr0_1 (U57.J9), v6_io_34_35_36_37_38 (U1.B14)
QDR0.D13: qdr0_1 (U57.G10), v6_io_34_35_36_37_38 (U1.A14)
QDR0.D14: qdr0_1 (U57.F9), v6_io_34_35_36_37_38 (U1.A16)
QDR0.D15: qdr0_1 (U57.D10), v6_io_34_35_36_37_38 (U1.L12)
QDR0.D16: qdr0_1 (U57.C9), v6_io_34_35_36_37_38 (U1.C14)
QDR0.D17: qdr0_1 (U57.B9), v6_io_34_35_36_37_38 (U1.E13)
QDR0.D18: qdr0_1 (U57.B3), v6_io_34_35_36_37_38 (U1.E20)
QDR0.D19: qdr0_1 (U57.C3), v6_io_34_35_36_37_38 (U1.F20)
QDR0.D20: qdr0_1 (U57.D2), v6_io_34_35_36_37_38 (U1.A21)
QDR0.D21: qdr0_1 (U57.F3), v6_io_34_35_36_37_38 (U1.C20)
QDR0.D22: qdr0_1 (U57.G2), v6_io_34_35_36_37_38 (U1.B22)
QDR0.D23: qdr0_1 (U57.J3), v6_io_34_35_36_37_38 (U1.L19)
QDR0.D24: qdr0_1 (U57.L3), v6_io_34_35_36_37_38 (U1.G23)
QDR0.D25: qdr0_1 (U57.M3), v6_io_34_35_36_37_38 (U1.L21)
QDR0.D26: qdr0_1 (U57.N2), v6_io_34_35_36_37_38 (U1.D23)
QDR0.D27: qdr0_1 (U57.C1), v6_io_34_35_36_37_38 (U1.B21)
QDR0.D28: qdr0_1 (U57.D1), v6_io_34_35_36_37_38 (U1.F21)
QDR0.D29: qdr0_1 (U57.E2), v6_io_34_35_36_37_38 (U1.G21)
QDR0.D30: qdr0_1 (U57.G1), v6_io_34_35_36_37_38 (U1.D21)
QDR0.D31: qdr0_1 (U57.J1), v6_io_34_35_36_37_38 (U1.K22)
QDR0.D32: qdr0_1 (U57.K2), v6_io_34_35_36_37_38 (U1.L20)
QDR0.D33: qdr0_1 (U57.M1), v6_io_34_35_36_37_38 (U1.B23)
QDR0.D34: qdr0_1 (U57.N1), v6_io_34_35_36_37_38 (U1.D22)
QDR0.D35: qdr0_1 (U57.P2), v6_io_34_35_36_37_38 (U1.E24)
QDR0.DOFFn: qdr0_1 (U57.H1), v6_io_34_35_36_37_38 (U1.A19)
QDR0.K: qdr0_1 (U57.B6), v6_io_34_35_36_37_38 (U1.D17)
QDR0.Kn: qdr0_1 (U57.A6), v6_io_34_35_36_37_38 (U1.E17)
QDR0.Q0: qdr0_1 (U57.P11), v6_io_34_35_36_37_38 (U1.G14)
QDR0.Q1: qdr0_1 (U57.M10), v6_io_34_35_36_37_38 (U1.M14)
QDR0.Q2: qdr0_1 (U57.L11), v6_io_34_35_36_37_38 (U1.M12)
QDR0.Q3: qdr0_1 (U57.K11), v6_io_34_35_36_37_38 (U1.M13)
QDR0.Q4: qdr0_1 (U57.J10), v6_io_34_35_36_37_38 (U1.H14)
QDR0.Q5: qdr0_1 (U57.F11), v6_io_34_35_36_37_38 (U1.J13)
QDR0.Q6: qdr0_1 (U57.E11), v6_io_34_35_36_37_38 (U1.E12)
QDR0.Q7: qdr0_1 (U57.C10), v6_io_34_35_36_37_38 (U1.C13)
QDR0.Q8: qdr0_1 (U57.B11), v6_io_34_35_36_37_38 (U1.G12)
QDR0.Q9: qdr0_1 (U57.P9), v6_io_34_35_36_37_38 (U1.F15)
QDR0.Q10: qdr0_1 (U57.N9), v6_io_34_35_36_37_38 (U1.D16)
QDR0.Q11: qdr0_1 (U57.L10), v6_io_34_35_36_37_38 (U1.L11)
QDR0.Q12: qdr0_1 (U57.K9), v6_io_34_35_36_37_38 (U1.D15)
QDR0.Q13: qdr0_1 (U57.G9), v6_io_34_35_36_37_38 (U1.C15)
QDR0.Q14: qdr0_1 (U57.F10), v6_io_34_35_36_37_38 (U1.J11)
QDR0.Q15: qdr0_1 (U57.E9), v6_io_34_35_36_37_38 (U1.F14)
QDR0.Q16: qdr0_1 (U57.D9), v6_io_34_35_36_37_38 (U1.D13)
QDR0.Q17: qdr0_1 (U57.B10), v6_io_34_35_36_37_38 (U1.K14)
QDR0.Q18: qdr0_1 (U57.B2), v6_io_34_35_36_37_38 (U1.H21)
QDR0.Q19: qdr0_1 (U57.D3), v6_io_34_35_36_37_38 (U1.D20)
QDR0.Q20: qdr0_1 (U57.E3), v6_io_34_35_36_37_38 (U1.J20)
QDR0.Q21: qdr0_1 (U57.F2), v6_io_34_35_36_37_38 (U1.K20)
QDR0.Q22: qdr0_1 (U57.G3), v6_io_34_35_36_37_38 (U1.L22)
QDR0.Q23: qdr0_1 (U57.K3), v6_io_34_35_36_37_38 (U1.G22)
QDR0.Q24: qdr0_1 (U57.L2), v6_io_34_35_36_37_38 (U1.F22)
QDR0.Q25: qdr0_1 (U57.N3), v6_io_34_35_36_37_38 (U1.C23)
QDR0.Q26: qdr0_1 (U57.P3), v6_io_34_35_36_37_38 (U1.C24)
QDR0.Q27: qdr0_1 (U57.B1), v6_io_34_35_36_37_38 (U1.J21)
QDR0.Q28: qdr0_1 (U57.C2), v6_io_34_35_36_37_38 (U1.A20)
QDR0.Q29: qdr0_1 (U57.E1), v6_io_34_35_36_37_38 (U1.C21)
QDR0.Q30: qdr0_1 (U57.F1), v6_io_34_35_36_37_38 (U1.A24)
QDR0.Q31: qdr0_1 (U57.J2), v6_io_34_35_36_37_38 (U1.B24)
QDR0.Q32: qdr0_1 (U57.K1), v6_io_34_35_36_37_38 (U1.J22)
QDR0.Q33: qdr0_1 (U57.L1), v6_io_34_35_36_37_38 (U1.H23)
QDR0.Q34: qdr0_1 (U57.M2), v6_io_34_35_36_37_38 (U1.A22)
QDR0.Q35: qdr0_1 (U57.P1), v6_io_34_35_36_37_38 (U1.E23)
QDR0.RDn: qdr0_1 (RP14.4 U57.A8), v6_io_34_35_36_37_38 (U1.L16)
QDR0.WRn: qdr0_1 (RP9.2 U57.A4), v6_io_34_35_36_37_38 (U1.J18)
QDR0_TCK: jtag_levelxlate (U77.7), qdr0_1 (U57.R2)
QDR0_TDI: jtag_levelxlate (R480.2 U52.3), qdr0_1 (U57.R11)
QDR0_TDO: jtag_levelxlate (R481.1), qdr0_1 (U57.R1)
QDR0_TMS: jtag_levelxlate (U82.18), qdr0_1 (U57.R10)
QDR1.A0: qdr0_1 (RP12.1 U58.B4), v6_io_27_28_32_33 (U1.C30)
QDR1.A1: qdr0_1 (RP16.3 U58.B8), v6_io_27_28_32_33 (U1.A30)
QDR1.A2: qdr0_1 (R277.1 U58.C5), v6_io_27_28_32_33 (U1.G28)
QDR1.A3: qdr0_1 (R276.1 U58.C7), v6_io_27_28_32_33 (U1.E28)
QDR1.A4: qdr0_1 (RP15.2 U58.N5), v6_io_27_28_32_33 (U1.L26)
QDR1.A5: qdr0_1 (RP15.3 U58.N6), v6_io_27_28_32_33 (U1.G27)
QDR1.A6: qdr0_1 (RP15.4 U58.N7), v6_io_27_28_32_33 (U1.A31)
QDR1.A7: qdr0_1 (RP11.2 U58.P4), v6_io_27_28_32_33 (U1.J27)
QDR1.A8: qdr0_1 (RP11.4 U58.P5), v6_io_27_28_32_33 (U1.B29)
QDR1.A9: qdr0_1 (RP10.1 U58.P7), v6_io_27_28_32_33 (U1.R23)
QDR1.A10: qdr0_1 (RP10.3 U58.P8), v6_io_34_35_36_37_38 (U1.H26)
QDR1.A11: qdr0_1 (RP16.2 U58.A9), v6_io_27_28_32_33 (U1.F27)
QDR1.A12: qdr0_1 (RP11.1 U58.R3), v6_io_27_28_32_33 (U1.M26)
QDR1.A13: qdr0_1 (RP11.3 U58.R4), v6_io_27_28_32_33 (U1.N25)
QDR1.A14: qdr0_1 (RP15.1 U58.R5), v6_io_27_28_32_33 (U1.A29)
QDR1.A15: qdr0_1 (R274.1 U58.R7), v6_io_27_28_32_33 (U1.J26)
QDR1.A16: qdr0_1 (RP10.2 U58.R8), v6_io_27_28_32_33 (U1.N24)
QDR1.A17: qdr0_1 (RP10.4 U58.R9), v6_io_27_28_32_33 (U1.P23)
QDR1.A18: qdr0_1 (RP12.3 U58.A3), v6_io_27_28_32_33 (U1.L27)
QDR1.A19: qdr0_1 (RP16.1 U58.A10), v6_io_27_28_32_33 (U1.L25)
QDR1.A20: qdr0_1 (RP12.4 U58.A2), v6_io_27_28_32_33 (U1.A35)
QDR1.D0: qdr0_1 (U58.P10), v6_io_34_35_36_37_38 (U1.M24)
QDR1.D1: qdr0_1 (U58.N11), v6_io_34_35_36_37_38 (U1.P20)
QDR1.D2: qdr0_1 (U58.M11), v6_io_34_35_36_37_38 (U1.N21)
QDR1.D3: qdr0_1 (U58.K10), v6_io_34_35_36_37_38 (U1.F24)
QDR1.D4: qdr0_1 (U58.J11), v6_io_34_35_36_37_38 (U1.A25)
QDR1.D5: qdr0_1 (U58.G11), v6_io_34_35_36_37_38 (U1.A26)
QDR1.D6: qdr0_1 (U58.E10), v6_io_34_35_36_37_38 (U1.C25)
QDR1.D7: qdr0_1 (U58.D11), v6_io_34_35_36_37_38 (U1.B26)
QDR1.D8: qdr0_1 (U58.C11), v6_io_34_35_36_37_38 (U1.P22)
QDR1.D9: qdr0_1 (U58.N10), v6_io_34_35_36_37_38 (U1.M21)
QDR1.D10: qdr0_1 (U58.M9), v6_io_34_35_36_37_38 (U1.M22)
QDR1.D11: qdr0_1 (U58.L9), v6_io_34_35_36_37_38 (U1.G24)
QDR1.D12: qdr0_1 (U58.J9), v6_io_34_35_36_37_38 (U1.H24)
QDR1.D13: qdr0_1 (U58.G10), v6_io_34_35_36_37_38 (U1.F25)
QDR1.D14: qdr0_1 (U58.F9), v6_io_34_35_36_37_38 (U1.E25)
QDR1.D15: qdr0_1 (U58.D10), v6_io_34_35_36_37_38 (U1.D26)
QDR1.D16: qdr0_1 (U58.C9), v6_io_27_28_32_33 (U1.D28)
QDR1.D17: qdr0_1 (U58.B9), v6_io_34_35_36_37_38 (U1.E27)
QDR1.D18: qdr0_1 (U58.B3), v6_io_27_28_32_33 (U1.F31)
QDR1.D19: qdr0_1 (U58.C3), v6_io_27_28_32_33 (U1.C33)
QDR1.D20: qdr0_1 (U58.D2), v6_io_27_28_32_33 (U1.K28)
QDR1.D21: qdr0_1 (U58.F3), v6_io_27_28_32_33 (U1.D30)
QDR1.D22: qdr0_1 (U58.G2), v6_io_27_28_32_33 (U1.B34)
QDR1.D23: qdr0_1 (U58.J3), v6_io_27_28_32_33 (U1.B33)
QDR1.D24: qdr0_1 (U58.L3), v6_io_27_28_32_33 (U1.E35)
QDR1.D25: qdr0_1 (U58.M3), v6_io_27_28_32_33 (U1.D36)
QDR1.D26: qdr0_1 (U58.N2), v6_io_27_28_32_33 (U1.D37)
QDR1.D27: qdr0_1 (U58.C1), v6_io_27_28_32_33 (U1.E32)
QDR1.D28: qdr0_1 (U58.D1), v6_io_27_28_32_33 (U1.G32)
QDR1.D29: qdr0_1 (U58.E2), v6_io_27_28_32_33 (U1.K27)
QDR1.D30: qdr0_1 (U58.G1), v6_io_27_28_32_33 (U1.G33)
QDR1.D31: qdr0_1 (U58.J1), v6_io_27_28_32_33 (U1.H33)
QDR1.D32: qdr0_1 (U58.K2), v6_io_27_28_32_33 (U1.E33)
QDR1.D33: qdr0_1 (U58.M1), v6_io_27_28_32_33 (U1.C36)
QDR1.D34: qdr0_1 (U58.N1), v6_io_27_28_32_33 (U1.F34)
QDR1.D35: qdr0_1 (U58.P2), v6_io_27_28_32_33 (U1.D31)
QDR1.DOFFn: qdr0_1 (U58.H1), v6_io_27_28_32_33 (U1.R25)
QDR1.K: qdr0_1 (U58.B6), v6_io_27_28_32_33 (U1.B31)
QDR1.Kn: qdr0_1 (U58.A6), v6_io_27_28_32_33 (U1.F30)
QDR1.Q0: qdr0_1 (U58.P11), v6_io_34_35_36_37_38 (U1.M19)
QDR1.Q1: qdr0_1 (U58.M10), v6_io_34_35_36_37_38 (U1.K24)
QDR1.Q2: qdr0_1 (U58.L11), v6_io_34_35_36_37_38 (U1.P21)
QDR1.Q3: qdr0_1 (U58.K11), v6_io_34_35_36_37_38 (U1.K23)
QDR1.Q4: qdr0_1 (U58.J10), v6_io_34_35_36_37_38 (U1.J25)
QDR1.Q5: qdr0_1 (U58.F11), v6_io_34_35_36_37_38 (U1.D25)
QDR1.Q6: qdr0_1 (U58.E11), v6_io_34_35_36_37_38 (U1.F26)
QDR1.Q7: qdr0_1 (U58.C10), v6_io_34_35_36_37_38 (U1.G26)
QDR1.Q8: qdr0_1 (U58.B11), v6_io_34_35_36_37_38 (U1.D27)
QDR1.Q9: qdr0_1 (U58.P9), v6_io_34_35_36_37_38 (U1.K25)
QDR1.Q10: qdr0_1 (U58.N9), v6_io_34_35_36_37_38 (U1.L24)
QDR1.Q11: qdr0_1 (U58.L10), v6_io_34_35_36_37_38 (U1.J23)
QDR1.Q12: qdr0_1 (U58.K9), v6_io_34_35_36_37_38 (U1.N23)
QDR1.Q13: qdr0_1 (U58.G9), v6_io_34_35_36_37_38 (U1.B28)
QDR1.Q14: qdr0_1 (U58.F10), v6_io_34_35_36_37_38 (U1.B27)
QDR1.Q15: qdr0_1 (U58.E9), v6_io_34_35_36_37_38 (U1.A27)
QDR1.Q16: qdr0_1 (U58.D9), v6_io_34_35_36_37_38 (U1.C26)
QDR1.Q17: qdr0_1 (U58.B10), v6_io_34_35_36_37_38 (U1.C28)
QDR1.Q18: qdr0_1 (U58.B2), v6_io_27_28_32_33 (U1.H28)
QDR1.Q19: qdr0_1 (U58.D3), v6_io_27_28_32_33 (U1.A36)
QDR1.Q20: qdr0_1 (U58.E3), v6_io_27_28_32_33 (U1.B36)
QDR1.Q21: qdr0_1 (U58.F2), v6_io_27_28_32_33 (U1.E30)
QDR1.Q22: qdr0_1 (U58.G3), v6_io_27_28_32_33 (U1.G29)
QDR1.Q23: qdr0_1 (U58.K3), v6_io_27_28_32_33 (U1.J33)
QDR1.Q24: qdr0_1 (U58.L2), v6_io_27_28_32_33 (U1.D33)
QDR1.Q25: qdr0_1 (U58.N3), v6_io_27_28_32_33 (U1.B32)
QDR1.Q26: qdr0_1 (U58.P3), v6_io_27_28_32_33 (U1.J28)
QDR1.Q27: qdr0_1 (U58.B1), v6_io_27_28_32_33 (U1.F32)
QDR1.Q28: qdr0_1 (U58.C2), v6_io_27_28_32_33 (U1.C34)
QDR1.Q29: qdr0_1 (U58.E1), v6_io_27_28_32_33 (U1.D32)
QDR1.Q30: qdr0_1 (U58.F1), v6_io_27_28_32_33 (U1.J32)
QDR1.Q31: qdr0_1 (U58.J2), v6_io_27_28_32_33 (U1.A34)
QDR1.Q32: qdr0_1 (U58.K1), v6_io_27_28_32_33 (U1.C35)
QDR1.Q33: qdr0_1 (U58.L1), v6_io_27_28_32_33 (U1.E34)
QDR1.Q34: qdr0_1 (U58.M2), v6_io_27_28_32_33 (U1.A32)
QDR1.Q35: qdr0_1 (U58.P1), v6_io_27_28_32_33 (U1.P25)
QDR1.RDn: qdr0_1 (RP16.4 U58.A8), v6_io_27_28_32_33 (U1.C29)
QDR1.WRn: qdr0_1 (RP12.2 U58.A4), v6_io_27_28_32_33 (U1.C31)
QDR1_TCK: jtag_levelxlate (U77.5), qdr0_1 (U58.R2)
QDR1_TDI: jtag_levelxlate (R481.2), qdr0_1 (U58.R11)
QDR1_TDO: jtag_levelxlate (R482.1), qdr0_1 (U58.R1)
QDR1_TMS: jtag_levelxlate (U82.16), qdr0_1 (U58.R10)
QDR2.A0: qdr2_3 (RP19.1 U60.B4), v6_io_12_13_14_15 (U1.AK37)
QDR2.A1: qdr2_3 (RP24.3 U60.B8), v6_io_12_13_14_15 (U1.AG34)
QDR2.A2: qdr2_3 (R282.1 U60.C5), v6_io_12_13_14_15 (U1.AL40)
QDR2.A3: qdr2_3 (R280.1 U60.C7), v6_io_12_13_14_15 (U1.AK39)
QDR2.A4: qdr2_3 (RP23.2 U60.N5), v6_io_12_13_14_15 (U1.AJ41)
QDR2.A5: qdr2_3 (RP23.3 U60.N6), v6_io_12_13_14_15 (U1.AH41)
QDR2.A6: qdr2_3 (RP23.4 U60.N7), v6_io_12_13_14_15 (U1.AF39)
QDR2.A7: qdr2_3 (RP18.2 U60.P4), v6_io_12_13_14_15 (U1.AG39)
QDR2.A8: qdr2_3 (RP18.4 U60.P5), v6_io_12_13_14_15 (U1.AJ42)
QDR2.A9: qdr2_3 (RP17.1 U60.P7), v6_io_12_13_14_15 (U1.AG41)
QDR2.A10: qdr2_3 (RP17.3 U60.P8), v6_io_12_13_14_15 (U1.AG36)
QDR2.A11: qdr2_3 (RP24.2 U60.A9), v6_io_12_13_14_15 (U1.AK42)
QDR2.A12: qdr2_3 (RP18.1 U60.R3), v6_io_12_13_14_15 (U1.AJ40)
QDR2.A13: qdr2_3 (RP18.3 U60.R4), v6_io_12_13_14_15 (U1.AH39)
QDR2.A14: qdr2_3 (RP23.1 U60.R5), v6_io_12_13_14_15 (U1.AG38)
QDR2.A15: qdr2_3 (R278.1 U60.R7), v6_io_12_13_14_15 (U1.AG42)
QDR2.A16: qdr2_3 (RP17.2 U60.R8), v6_io_12_13_14_15 (U1.AF40)
QDR2.A17: qdr2_3 (RP17.4 U60.R9), v6_io_12_13_14_15 (U1.AJ35)
QDR2.A18: qdr2_3 (RP19.3 U60.A3), v6_io_12_13_14_15 (U1.AK38)
QDR2.A19: qdr2_3 (RP24.1 U60.A10), v6_io_12_13_14_15 (U1.AF37)
QDR2.A20: qdr2_3 (RP19.4 U60.A2), v6_io_12_13_14_15 (U1.AL39)
QDR2.D0: qdr2_3 (U60.P10), v6_io_12_13_14_15 (U1.AA41)
QDR2.D1: qdr2_3 (U60.N11), v6_io_12_13_14_15 (U1.AB41)
QDR2.D2: qdr2_3 (U60.M11), v6_io_12_13_14_15 (U1.AB36)
QDR2.D3: qdr2_3 (U60.K10), v6_io_12_13_14_15 (U1.AB33)
QDR2.D4: qdr2_3 (U60.J11), v6_io_12_13_14_15 (U1.AD42)
QDR2.D5: qdr2_3 (U60.G11), v6_io_12_13_14_15 (U1.AB32)
QDR2.D6: qdr2_3 (U60.E10), v6_io_12_13_14_15 (U1.AE40)
QDR2.D7: qdr2_3 (U60.D11), v6_io_12_13_14_15 (U1.AD37)
QDR2.D8: qdr2_3 (U60.C11), v6_io_12_13_14_15 (U1.AC33)
QDR2.D9: qdr2_3 (U60.N10), v6_io_12_13_14_15 (U1.AA42)
QDR2.D10: qdr2_3 (U60.M9), v6_io_12_13_14_15 (U1.AB39)
QDR2.D11: qdr2_3 (U60.L9), v6_io_12_13_14_15 (U1.AB38)
QDR2.D12: qdr2_3 (U60.J9), v6_io_12_13_14_15 (U1.AD41)
QDR2.D13: qdr2_3 (U60.G10), v6_io_12_13_14_15 (U1.AC36)
QDR2.D14: qdr2_3 (U60.F9), v6_io_12_13_14_15 (U1.AE39)
QDR2.D15: qdr2_3 (U60.D10), v6_io_12_13_14_15 (U1.AD36)
QDR2.D16: qdr2_3 (U60.C9), v6_io_12_13_14_15 (U1.AE34)
QDR2.D17: qdr2_3 (U60.B9), v6_io_12_13_14_15 (U1.AG37)
QDR2.D18: qdr2_3 (U60.B3), v6_io_12_13_14_15 (U1.AJ37)
QDR2.D19: qdr2_3 (U60.C3), v6_io_12_13_14_15 (U1.AJ38)
QDR2.D20: qdr2_3 (U60.D2), v6_io_12_13_14_15 (U1.AM39)
QDR2.D21: qdr2_3 (U60.F3), v6_io_12_13_14_15 (U1.AL41)
QDR2.D22: qdr2_3 (U60.G2), v6_io_12_13_14_15 (U1.AF34)
QDR2.D23: qdr2_3 (U60.J3), v6_io_12_13_14_15 (U1.AD32)
QDR2.D24: qdr2_3 (U60.L3), v6_io_12_13_14_15 (U1.AP35)
QDR2.D25: qdr2_3 (U60.M3), v6_io_27_28_32_33 (U1.AR20)
QDR2.D26: qdr2_3 (U60.N2), v6_io_12_13_14_15 (U1.AF36)
QDR2.D27: qdr2_3 (U60.C1), v6_io_12_13_14_15 (U1.AM38)
QDR2.D28: qdr2_3 (U60.D1), v6_io_12_13_14_15 (U1.AP41)
QDR2.D29: qdr2_3 (U60.E2), v6_io_12_13_14_15 (U1.AK40)
QDR2.D30: qdr2_3 (U60.G1), v6_io_27_28_32_33 (U1.AT20)
QDR2.D31: qdr2_3 (U60.J1), v6_io_12_13_14_15 (U1.AP42)
QDR2.D32: qdr2_3 (U60.K2), v6_io_12_13_14_15 (U1.AM37)
QDR2.D33: qdr2_3 (U60.M1), v6_io_23_24_25_26 (U1.AM31)
QDR2.D34: qdr2_3 (U60.N1), v6_io_23_24_25_26 (U1.AR32)
QDR2.D35: qdr2_3 (U60.P2), v6_io_23_24_25_26 (U1.AU32)
QDR2.DOFFn: qdr2_3 (U60.H1), v6_io_34_35_36_37_38 (U1.P18)
QDR2.K: qdr2_3 (U60.B6), v6_io_12_13_14_15 (U1.AH40)
QDR2.Kn: qdr2_3 (U60.A6), v6_io_12_13_14_15 (U1.AM42)
QDR2.Q0: qdr2_3 (U60.P11), v6_io_12_13_14_15 (U1.AA40)
QDR2.Q1: qdr2_3 (U60.M10), v6_io_12_13_14_15 (U1.AE33)
QDR2.Q2: qdr2_3 (U60.L11), v6_io_12_13_14_15 (U1.AE32)
QDR2.Q3: qdr2_3 (U60.K11), v6_io_12_13_14_15 (U1.AC40)
QDR2.Q4: qdr2_3 (U60.J10), v6_io_12_13_14_15 (U1.AC34)
QDR2.Q5: qdr2_3 (U60.F11), v6_io_12_13_14_15 (U1.AE42)
QDR2.Q6: qdr2_3 (U60.E11), v6_io_12_13_14_15 (U1.AD33)
QDR2.Q7: qdr2_3 (U60.C10), v6_io_12_13_14_15 (U1.AE38)
QDR2.Q8: qdr2_3 (U60.B11), v6_io_12_13_14_15 (U1.AE37)
QDR2.Q9: qdr2_3 (U60.P9), v6_io_12_13_14_15 (U1.AB42)
QDR2.Q10: qdr2_3 (U60.N9), v6_io_12_13_14_15 (U1.AB37)
QDR2.Q11: qdr2_3 (U60.L10), v6_io_12_13_14_15 (U1.AC41)
QDR2.Q12: qdr2_3 (U60.K9), v6_io_12_13_14_15 (U1.AC38)
QDR2.Q13: qdr2_3 (U60.G9), v6_io_12_13_14_15 (U1.AD40)
QDR2.Q14: qdr2_3 (U60.F10), v6_io_12_13_14_15 (U1.AD38)
QDR2.Q15: qdr2_3 (U60.E9), v6_io_12_13_14_15 (U1.AF41)
QDR2.Q16: qdr2_3 (U60.D9), v6_io_12_13_14_15 (U1.AF42)
QDR2.Q17: qdr2_3 (U60.B10), v6_io_12_13_14_15 (U1.AE35)
QDR2.Q18: qdr2_3 (U60.B2), v6_io_12_13_14_15 (U1.AR38)
QDR2.Q19: qdr2_3 (U60.D3), v6_io_27_28_32_33 (U1.AJ21)
QDR2.Q20: qdr2_3 (U60.E3), v6_io_12_13_14_15 (U1.AP37)
QDR2.Q21: qdr2_3 (U60.F2), v6_io_12_13_14_15 (U1.AT37)
QDR2.Q22: qdr2_3 (U60.G3), v6_io_12_13_14_15 (U1.AN36)
QDR2.Q23: qdr2_3 (U60.K3), v6_io_27_28_32_33 (U1.AV23)
QDR2.Q24: qdr2_3 (U60.L2), v6_io_27_28_32_33 (U1.AU22)
QDR2.Q25: qdr2_3 (U60.N3), v6_io_27_28_32_33 (U1.BB24)
QDR2.Q26: qdr2_3 (U60.P3), v6_io_12_13_14_15 (U1.BA39)
QDR2.Q27: qdr2_3 (U60.B1), v6_io_12_13_14_15 (U1.AU37)
QDR2.Q28: qdr2_3 (U60.C2), v6_io_27_28_32_33 (U1.AN21)
QDR2.Q29: qdr2_3 (U60.E1), v6_io_12_13_14_15 (U1.AT36)
QDR2.Q30: qdr2_3 (U60.F1), v6_io_12_13_14_15 (U1.AV39)
QDR2.Q31: qdr2_3 (U60.J2), v6_io_12_13_14_15 (U1.AY39)
QDR2.Q32: qdr2_3 (U60.K1), v6_io_27_28_32_33 (U1.AY24)
QDR2.Q33: qdr2_3 (U60.L1), v6_io_27_28_32_33 (U1.AW22)
QDR2.Q34: qdr2_3 (U60.M2), v6_io_27_28_32_33 (U1.AR22)
QDR2.Q35: qdr2_3 (U60.P1), v6_io_27_28_32_33 (U1.BA24)
QDR2.RDn: qdr2_3 (RP24.4 U60.A8), v6_io_12_13_14_15 (U1.AL42)
QDR2.WRn: qdr2_3 (RP19.2 U60.A4), v6_io_12_13_14_15 (U1.AM41)
QDR2_TCK: jtag_levelxlate (U77.3), qdr2_3 (U60.R2)
QDR2_TDI: jtag_levelxlate (R482.2), qdr2_3 (U60.R11)
QDR2_TDO: jtag_levelxlate (R483.1), qdr2_3 (U60.R1)
QDR2_TMS: jtag_levelxlate (U82.14), qdr2_3 (U60.R10)
QDR3.A0: qdr2_3 (RP22.1 U61.B4), v6_io_27_28_32_33 (U1.AK19)
QDR3.A1: qdr2_3 (RP26.3 U61.B8), v6_io_27_28_32_33 (U1.AT21)
QDR3.A2: qdr2_3 (R283.1 U61.C5), v6_io_27_28_32_33 (U1.AL19)
QDR3.A3: qdr2_3 (R281.1 U61.C7), v6_io_27_28_32_33 (U1.AP20)
QDR3.A4: qdr2_3 (RP25.2 U61.N5), v6_io_27_28_32_33 (U1.AM19)
QDR3.A5: qdr2_3 (RP25.3 U61.N6), v6_io_27_28_32_33 (U1.AM21)
QDR3.A6: qdr2_3 (RP25.4 U61.N7), v6_io_27_28_32_33 (U1.AP22)
QDR3.A7: qdr2_3 (RP21.2 U61.P4), v6_io_27_28_32_33 (U1.BA20)
QDR3.A8: qdr2_3 (RP21.4 U61.P5), v6_io_27_28_32_33 (U1.AL21)
QDR3.A9: qdr2_3 (RP20.1 U61.P7), v6_io_27_28_32_33 (U1.BB22)
QDR3.A10: qdr2_3 (RP20.3 U61.P8), v6_io_27_28_32_33 (U1.BA22)
QDR3.A11: qdr2_3 (RP26.2 U61.A9), v6_io_27_28_32_33 (U1.AV20)
QDR3.A12: qdr2_3 (RP21.1 U61.R3), v6_io_27_28_32_33 (U1.AY20)
QDR3.A13: qdr2_3 (RP21.3 U61.R4), v6_io_27_28_32_33 (U1.AW23)
QDR3.A14: qdr2_3 (RP25.1 U61.R5), v6_io_27_28_32_33 (U1.BB23)
QDR3.A15: qdr2_3 (R279.1 U61.R7), v6_io_27_28_32_33 (U1.BB21)
QDR3.A16: qdr2_3 (RP20.2 U61.R8), v6_io_27_28_32_33 (U1.AT22)
QDR3.A17: qdr2_3 (RP20.4 U61.R9), v6_io_27_28_32_33 (U1.AY22)
QDR3.A18: qdr2_3 (RP22.3 U61.A3), v6_io_27_28_32_33 (U1.AJ20)
QDR3.A19: qdr2_3 (RP26.1 U61.A10), v6_io_27_28_32_33 (U1.AW20)
QDR3.A20: qdr2_3 (RP22.4 U61.A2), v6_io_27_28_32_33 (U1.AJ18)
QDR3.D0: qdr2_3 (U61.P10), v6_config_io_16_17_21_22 (U1.AN24)
QDR3.D1: qdr2_3 (U61.N11), v6_config_io_16_17_21_22 (U1.BB27)
QDR3.D2: qdr2_3 (U61.M11), v6_config_io_16_17_21_22 (U1.BB26)
QDR3.D3: qdr2_3 (U61.K10), v6_config_io_16_17_21_22 (U1.AT26)
QDR3.D4: qdr2_3 (U61.J11), v6_config_io_16_17_21_22 (U1.AU24)
QDR3.D5: qdr2_3 (U61.G11), v6_config_io_16_17_21_22 (U1.AR24)
QDR3.D6: qdr2_3 (U61.E10), v6_config_io_16_17_21_22 (U1.AR23)
QDR3.D7: qdr2_3 (U61.D11), v6_config_io_16_17_21_22 (U1.AL24)
QDR3.D8: qdr2_3 (U61.C11), v6_config_io_16_17_21_22 (U1.AL22)
QDR3.D9: qdr2_3 (U61.N10), v6_config_io_16_17_21_22 (U1.AN25)
QDR3.D10: qdr2_3 (U61.M9), v6_config_io_16_17_21_22 (U1.AW27)
QDR3.D11: qdr2_3 (U61.L9), v6_config_io_16_17_21_22 (U1.AU26)
QDR3.D12: qdr2_3 (U61.J9), v6_config_io_16_17_21_22 (U1.AW25)
QDR3.D13: qdr2_3 (U61.G10), v6_config_io_16_17_21_22 (U1.AR25)
QDR3.D14: qdr2_3 (U61.F9), v6_config_io_16_17_21_22 (U1.AU23)
QDR3.D15: qdr2_3 (U61.D10), v6_config_io_16_17_21_22 (U1.AM22)
QDR3.D16: qdr2_3 (U61.C9), v6_config_io_16_17_21_22 (U1.AK23)
QDR3.D17: qdr2_3 (U61.B9), v6_config_io_16_17_21_22 (U1.AJ23)
QDR3.D18: qdr2_3 (U61.B3), v6_io_27_28_32_33 (U1.AR17)
QDR3.D19: qdr2_3 (U61.C3), v6_io_27_28_32_33 (U1.AP17)
QDR3.D20: qdr2_3 (U61.D2), v6_io_27_28_32_33 (U1.AU17)
QDR3.D21: qdr2_3 (U61.F3), v6_io_27_28_32_33 (U1.AU18)
QDR3.D22: qdr2_3 (U61.G2), v6_io_27_28_32_33 (U1.AL15)
QDR3.D23: qdr2_3 (U61.J3), v6_io_27_28_32_33 (U1.AU19)
QDR3.D24: qdr2_3 (U61.L3), v6_io_27_28_32_33 (U1.AY18)
QDR3.D25: qdr2_3 (U61.M3), v6_io_27_28_32_33 (U1.BB18)
QDR3.D26: qdr2_3 (U61.N2), v6_io_27_28_32_33 (U1.BB19)
QDR3.D27: qdr2_3 (U61.C1), v6_io_27_28_32_33 (U1.AM17)
QDR3.D28: qdr2_3 (U61.D1), v6_io_27_28_32_33 (U1.AM16)
QDR3.D29: qdr2_3 (U61.E2), v6_io_27_28_32_33 (U1.AJ16)
QDR3.D30: qdr2_3 (U61.G1), v6_io_27_28_32_33 (U1.AN15)
QDR3.D31: qdr2_3 (U61.J1), v6_io_27_28_32_33 (U1.AK15)
QDR3.D32: qdr2_3 (U61.K2), v6_io_27_28_32_33 (U1.AM14)
QDR3.D33: qdr2_3 (U61.M1), v6_io_27_28_32_33 (U1.AP18)
QDR3.D34: qdr2_3 (U61.N1), v6_io_27_28_32_33 (U1.AN18)
QDR3.D35: qdr2_3 (U61.P2), v6_io_27_28_32_33 (U1.AN19)
QDR3.DOFFn: qdr2_3 (U61.H1), v6_io_27_28_32_33 (U1.AL17)
QDR3.K: qdr2_3 (U61.B6), v6_io_27_28_32_33 (U1.AN20)
QDR3.Kn: qdr2_3 (U61.A6), v6_io_27_28_32_33 (U1.AP21)
QDR3.Q0: qdr2_3 (U61.P11), v6_config_io_16_17_21_22 (U1.AY27)
QDR3.Q1: qdr2_3 (U61.M10), v6_config_io_16_17_21_22 (U1.AV26)
QDR3.Q2: qdr2_3 (U61.L11), v6_config_io_16_17_21_22 (U1.AW26)
QDR3.Q3: qdr2_3 (U61.K11), v6_config_io_16_17_21_22 (U1.BA25)
QDR3.Q4: qdr2_3 (U61.J10), v6_config_io_16_17_21_22 (U1.AT25)
QDR3.Q5: qdr2_3 (U61.F11), v6_config_io_16_17_21_22 (U1.AT24)
QDR3.Q6: qdr2_3 (U61.E11), v6_config_io_16_17_21_22 (U1.AP23)
QDR3.Q7: qdr2_3 (U61.C10), v6_config_io_16_17_21_22 (U1.AM23)
QDR3.Q8: qdr2_3 (U61.B11), v6_config_io_16_17_21_22 (U1.AK24)
QDR3.Q9: qdr2_3 (U61.P9), v6_config_io_16_17_21_22 (U1.AU27)
QDR3.Q10: qdr2_3 (U61.N9), v6_config_io_16_17_21_22 (U1.AP26)
QDR3.Q11: qdr2_3 (U61.L10), v6_config_io_16_17_21_22 (U1.BA26)
QDR3.Q12: qdr2_3 (U61.K9), v6_config_io_16_17_21_22 (U1.AL25)
QDR3.Q13: qdr2_3 (U61.G9), v6_config_io_16_17_21_22 (U1.AP25)
QDR3.Q14: qdr2_3 (U61.F10), v6_config_io_16_17_21_22 (U1.AK22)
QDR3.Q15: qdr2_3 (U61.E9), v6_config_io_16_17_21_22 (U1.AJ22)
QDR3.Q16: qdr2_3 (U61.D9), v6_config_io_16_17_21_22 (U1.AN23)
QDR3.Q17: qdr2_3 (U61.B10), v6_config_io_16_17_21_22 (U1.AM24)
QDR3.Q18: qdr2_3 (U61.B2), v6_io_27_28_32_33 (U1.AT17)
QDR3.Q19: qdr2_3 (U61.D3), v6_io_27_28_32_33 (U1.AV18)
QDR3.Q20: qdr2_3 (U61.E3), v6_io_27_28_32_33 (U1.AR19)
QDR3.Q21: qdr2_3 (U61.F2), v6_io_27_28_32_33 (U1.AR18)
QDR3.Q22: qdr2_3 (U61.G3), v6_io_27_28_32_33 (U1.AW18)
QDR3.Q23: qdr2_3 (U61.K3), v6_io_27_28_32_33 (U1.AV19)
QDR3.Q24: qdr2_3 (U61.L2), v6_io_27_28_32_33 (U1.AJ17)
QDR3.Q25: qdr2_3 (U61.N3), v6_io_27_28_32_33 (U1.AY19)
QDR3.Q26: qdr2_3 (U61.P3), v6_io_27_28_32_33 (U1.BA19)
QDR3.Q27: qdr2_3 (U61.B1), v6_io_27_28_32_33 (U1.AT16)
QDR3.Q28: qdr2_3 (U61.C2), v6_io_27_28_32_33 (U1.AK18)
QDR3.Q29: qdr2_3 (U61.E1), v6_io_27_28_32_33 (U1.AK17)
QDR3.Q30: qdr2_3 (U61.F1), v6_io_27_28_32_33 (U1.AP16)
QDR3.Q31: qdr2_3 (U61.J2), v6_io_27_28_32_33 (U1.AT19)
QDR3.Q32: qdr2_3 (U61.K1), v6_io_27_28_32_33 (U1.AN16)
QDR3.Q33: qdr2_3 (U61.L1), v6_io_27_28_32_33 (U1.AL14)
QDR3.Q34: qdr2_3 (U61.M2), v6_io_27_28_32_33 (U1.AJ15)
QDR3.Q35: qdr2_3 (U61.P1), v6_io_27_28_32_33 (U1.AK14)
QDR3.RDn: qdr2_3 (RP26.4 U61.A8), v6_io_27_28_32_33 (U1.AU21)
QDR3.WRn: qdr2_3 (RP22.2 U61.A4), v6_io_27_28_32_33 (U1.AK20)
QDR3_TCK: jtag_levelxlate (U79.18), qdr2_3 (U61.R2)
QDR3_TDI: jtag_levelxlate (R483.2), qdr2_3 (U61.R11)
QDR3_TDO: jtag_levelxlate (R484.1), qdr2_3 (U61.R1)
QDR3_TMS: jtag_levelxlate (U82.12), qdr2_3 (U61.R10)
RESET_PBn: gpio_led (P16.12 R346.1 S5.1), power_supply (U90.6)
SM_DBUSY: ppc_cpld (U46.78), v6_config_io_16_17_21_22 (U1.AK10)
SM_DONE: gpio_led (Q14.1 R460.2), ppc_serial (R148.2), v6_config_io_16_17_21_22 (R261.1 U1.N10)
SM_INITn: ppc_serial (R147.2), v6_config_io_16_17_21_22 (R259.1 U1.N11)
SM_PROGn: ppc_serial (R144.2), v6_config_io_16_17_21_22 (R258.1 U1.M11)
SM_RDWRn: ppc_serial (R143.2), v6_config_io_16_17_21_22 (U1.J10)
SYS_CLK_N: gpio_led (U72.4), v6_io_34_35_36_37_38 (U1.AP12)
SYS_CLK_P: gpio_led (U72.5), v6_io_34_35_36_37_38 (U1.AP11)
SYS_PORn: power_supply (R20.2), ppc_cpld (R359.1), ppc_extbus (U30.B5), ppc_net (R231.1), ppc_sys (R81.1 U2.A6 U2.AD31 U29.1), v6_net (R402.1)
SYS_WPn: ppc_cpld (R343.1 U46.32), ppc_extbus (U30.B4), ppc_serial (Q11.1)
TRC_HALT: jtag_levelxlate (P17.11), ppc_serial (R270.2), ppc_sys (P2.7 R96.1 U2.E32)
V6_GPIO0: gpio_led (P15.17 SP36.2 U68.3), v6_io_27_28_32_33 (U1.G31)
V6_GPIO1: gpio_led (P15.15 SP35.2 U68.4), v6_io_27_28_32_33 (U1.H31)
V6_GPIO2: gpio_led (P15.13 SP34.2 U68.5), v6_io_12_13_14_15 (U1.AF32)
V6_GPIO3: gpio_led (P15.11 SP33.2 U68.6), v6_io_12_13_14_15 (U1.AG33)
V6_GPIO4: gpio_led (P15.9 SP32.2 U68.7), v6_io_27_28_32_33 (U1.L30)
V6_GPIO5: gpio_led (P15.7 SP31.2 U68.8), v6_io_27_28_32_33 (U1.H30)
V6_GPIO6: gpio_led (P15.5 SP30.2 U68.9), v6_io_27_28_32_33 (U1.M29)
V6_GPIO7: gpio_led (P15.3 SP29.2 U68.10), v6_io_27_28_32_33 (U1.J30)
V6_GPIO8: gpio_led (P13.17 SP28.2), v6_io_27_28_32_33 (U1.M28)
V6_GPIO9: gpio_led (P13.15 SP27.2), v6_io_27_28_32_33 (U1.K30)
V6_GPIO10: gpio_led (P13.13 SP26.2), v6_io_34_35_36_37_38 (U1.N19)
V6_GPIO11: gpio_led (P13.11 SP25.2), v6_io_34_35_36_37_38 (U1.N20)